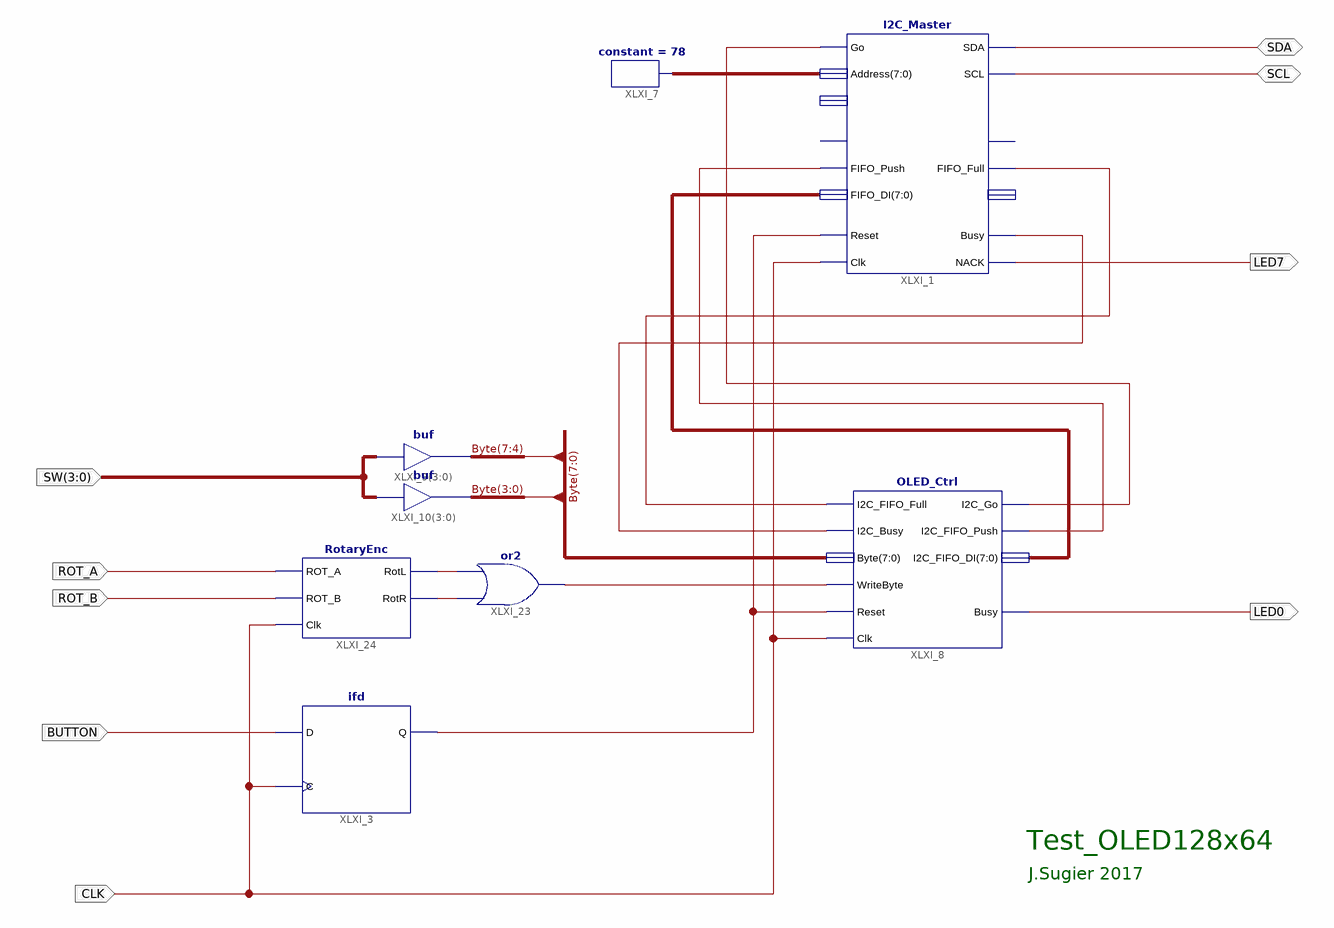
[diagram p0: schematic sheet 1]
// Xilinx ISE schematic top.sch (spartan3e) as structural Verilog: 8 symbols, 9 ports
module top (
  input  BUTTON,
  input  CLK,
  input  ROT_B,
  input  ROT_A,
  input  [3:0] SW,
  inout  SDA,
  inout  SCL,
  output LED7,
  output LED0
);

  wire XLXN_12, XLXN_21, XLXN_23, XLXN_25, XLXN_53, XLXN_140, XLXN_141, XLXN_156;
  wire [7:0] Byte, XLXN_51, XLXN_95;

  constant #(.CValue("78")) XLXI_7 (.O(XLXN_95));
  I2C_Master XLXI_1 (
    .Clk(CLK), .Reset(XLXN_12), .Go(XLXN_21), .FIFO_Push(XLXN_23), .Address(XLXN_95), .FIFO_DI(XLXN_51),
    .SDA(SDA), .SCL(SCL), .NACK(LED7), .Busy(XLXN_25), .FIFO_Full(XLXN_53));  // open: FIFO_Pop, ReadCnt, FIFO_Empty, FIFO_DO
  OLED_Ctrl XLXI_8 (
    .Clk(CLK), .Reset(XLXN_12), .WriteByte(XLXN_156), .I2C_FIFO_Full(XLXN_53), .I2C_Busy(XLXN_25),
    .Byte(Byte), .Busy(LED0), .I2C_Go(XLXN_21), .I2C_FIFO_Push(XLXN_23), .I2C_FIFO_DI(XLXN_51));
  ifd XLXI_3 (.C(CLK), .D(BUTTON), .Q(XLXN_12));
  or XLXI_23 (XLXN_156, XLXN_141, XLXN_140);
  assign Byte[7:4] = SW;  // buf XLXI_9[3..0], 4 bits wide
  assign Byte[3:0] = SW;  // buf XLXI_10[3..0], 4 bits wide
  RotaryEnc XLXI_24 (.ROT_A(ROT_A), .ROT_B(ROT_B), .RotL(XLXN_140), .RotR(XLXN_141), .Clk(CLK));

  // Notes on the sheet:
  //   Test_OLED128x64
  //   J.Sugier 2017
endmodule
